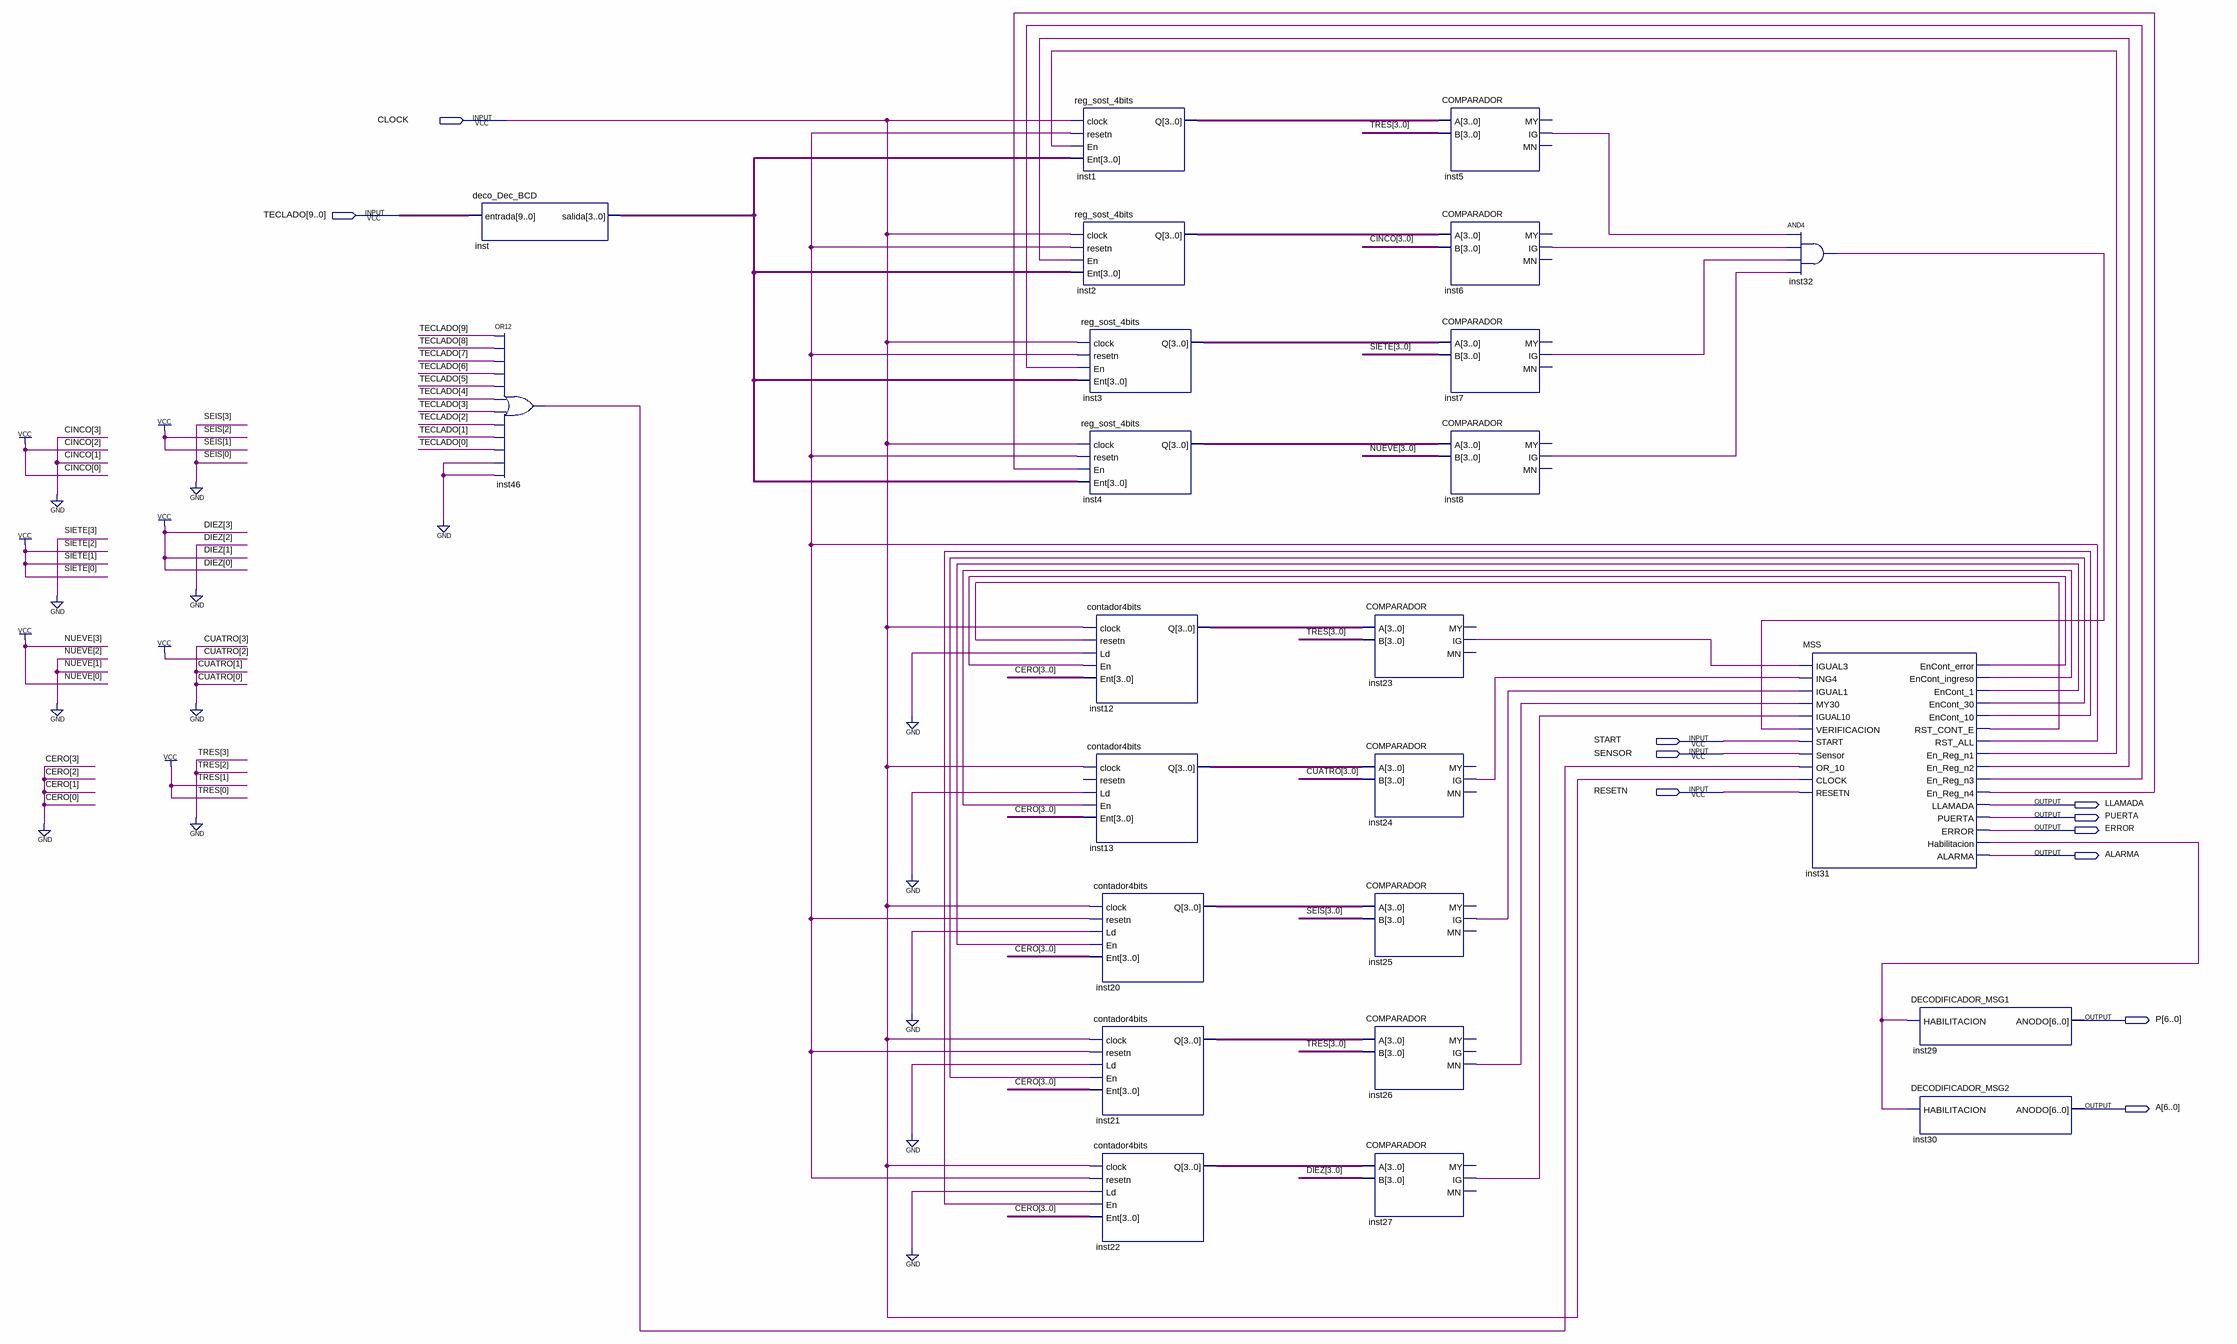
[diagram p0: schematic sheet]
// Quartus schematic PROYECTO.bdf as structural Verilog: 24 symbols, 11 pins
module PROYECTO (
  input  CLOCK,
  input  [9:0] TECLADO,
  input  START,
  input  SENSOR,
  input  RESETN,
  output LLAMADA,
  output PUERTA,
  output ERROR,
  output ALARMA,
  output [6:0] P,
  output [6:0] A
);

  wire inst5_ig, inst6_ig, inst7_ig, inst8_ig, inst23_ig, inst24_ig, inst25_ig, inst26_mn, inst27_ig,
       inst31_en_reg_n1, inst31_en_reg_n2, inst31_en_reg_n3, inst31_en_reg_n4, inst31_encont_1,
       inst31_encont_10, inst31_encont_30, inst31_encont_error, inst31_encont_ingreso, inst31_habilitacion,
       inst31_rst_all, inst31_rst_cont_e, inst32_out, inst46_out;
  wire [3:0] inst1_q, inst2_q, inst3_q, inst4_q, inst12_q, inst13_q, inst20_q, inst21_q, inst22_q,
       inst_salida;

  deco_Dec_BCD inst (.entrada(TECLADO), .salida(inst_salida));
  or inst46 (inst46_out, TECLADO[9], TECLADO[8], TECLADO[7], TECLADO[6], TECLADO[5], TECLADO[4], TECLADO[3], TECLADO[2], TECLADO[1], TECLADO[0], 1'b0, 1'b0);
  reg_sost_4bits inst1 (.clock(CLOCK), .resetn(inst31_rst_all), .En(inst31_en_reg_n1), .Ent(inst_salida), .Q(inst1_q));
  reg_sost_4bits inst2 (.clock(CLOCK), .resetn(inst31_rst_all), .En(inst31_en_reg_n2), .Ent(inst_salida), .Q(inst2_q));
  reg_sost_4bits inst3 (.clock(CLOCK), .resetn(inst31_rst_all), .En(inst31_en_reg_n3), .Ent(inst_salida), .Q(inst3_q));
  reg_sost_4bits inst4 (.clock(CLOCK), .resetn(inst31_rst_all), .En(inst31_en_reg_n4), .Ent(inst_salida), .Q(inst4_q));
  contador4bits inst12 (
    .clock(CLOCK), .resetn(inst31_rst_cont_e), .Ld(1'b0), .En(inst31_encont_error), .Ent(4'b0000),
    .Q(inst12_q));
  contador4bits inst13 (
    .clock(CLOCK), .Ld(1'b0), .En(inst31_encont_ingreso), .Ent(4'b0000), .Q(inst13_q));  // open: resetn
  contador4bits inst20 (
    .clock(CLOCK), .resetn(inst31_rst_all), .Ld(1'b0), .En(inst31_encont_1), .Ent(4'b0000), .Q(inst20_q));
  contador4bits inst21 (
    .clock(CLOCK), .resetn(inst31_rst_all), .Ld(1'b0), .En(inst31_encont_30), .Ent(4'b0000), .Q(inst21_q));
  contador4bits inst22 (
    .clock(CLOCK), .resetn(inst31_rst_all), .Ld(1'b0), .En(inst31_encont_10), .Ent(4'b0000), .Q(inst22_q));
  COMPARADOR inst23 (.A(inst12_q), .B(4'b0011), .IG(inst23_ig));  // open: MY, MN
  COMPARADOR inst24 (.A(inst13_q), .B(4'b0100), .IG(inst24_ig));  // open: MY, MN
  COMPARADOR inst25 (.A(inst20_q), .B(4'b0110), .IG(inst25_ig));  // open: MY, MN
  COMPARADOR inst26 (.A(inst21_q), .B(4'b0011), .MN(inst26_mn));  // open: MY, IG
  COMPARADOR inst27 (.A(inst22_q), .B(4'b1011), .IG(inst27_ig));  // open: MY, MN
  COMPARADOR inst5 (.A(inst1_q), .B(4'b0011), .IG(inst5_ig));  // open: MY, MN
  COMPARADOR inst6 (.A(inst2_q), .B(4'b0101), .IG(inst6_ig));  // open: MY, MN
  COMPARADOR inst7 (.A(inst3_q), .B(4'b0111), .IG(inst7_ig));  // open: MY, MN
  COMPARADOR inst8 (.A(inst4_q), .B(4'b1001), .IG(inst8_ig));  // open: MY, MN
  and inst32 (inst32_out, inst5_ig, inst6_ig, inst7_ig, inst8_ig);
  MSS inst31 (
    .IGUAL3(inst23_ig), .ING4(inst24_ig), .IGUAL1(inst25_ig), .MY30(inst26_mn), .IGUAL10(inst27_ig),
    .VERIFICACION(inst32_out), .START(START), .Sensor(SENSOR), .OR_10(inst46_out), .CLOCK(CLOCK),
    .RESETN(RESETN), .EnCont_error(inst31_encont_error), .EnCont_ingreso(inst31_encont_ingreso),
    .EnCont_1(inst31_encont_1), .EnCont_30(inst31_encont_30), .EnCont_10(inst31_encont_10),
    .RST_CONT_E(inst31_rst_cont_e), .RST_ALL(inst31_rst_all), .En_Reg_n1(inst31_en_reg_n1),
    .En_Reg_n2(inst31_en_reg_n2), .En_Reg_n3(inst31_en_reg_n3), .En_Reg_n4(inst31_en_reg_n4),
    .LLAMADA(LLAMADA), .PUERTA(PUERTA), .ERROR(ERROR), .Habilitacion(inst31_habilitacion), .ALARMA(ALARMA));
  DECODIFICADOR_MSG1 inst29 (.HABILITACION(inst31_habilitacion), .ANODO(P));
  DECODIFICADOR_MSG2 inst30 (.HABILITACION(inst31_habilitacion), .ANODO(A));
endmodule
